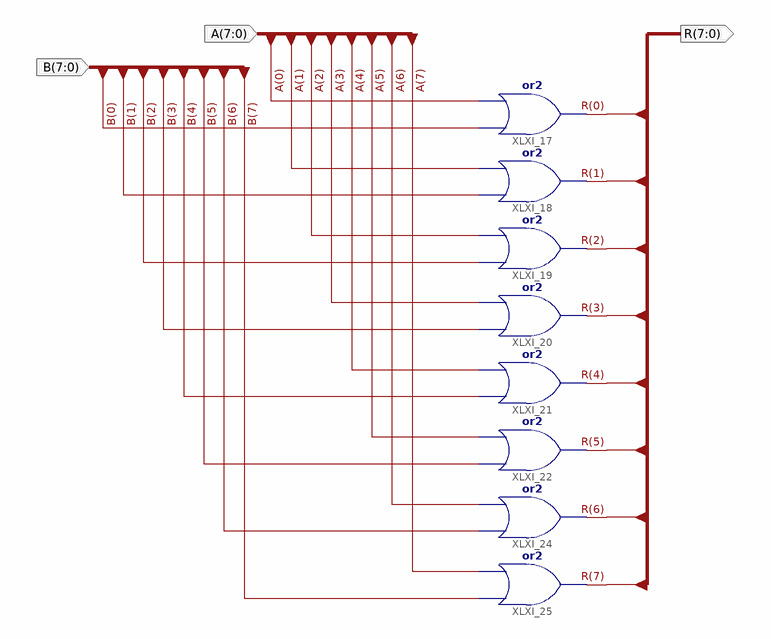
[diagram p0: schematic sheet 1]
// Xilinx ISE schematic or2x8b.sch (spartan6) as structural Verilog: 8 symbols, 3 ports
module or2x8b (
  input  [7:0] B,
  input  [7:0] A,
  output [7:0] R
);

  or XLXI_17 (R[0], B[0], A[0]);
  or XLXI_18 (R[1], B[1], A[1]);
  or XLXI_19 (R[2], B[2], A[2]);
  or XLXI_20 (R[3], B[3], A[3]);
  or XLXI_21 (R[4], B[4], A[4]);
  or XLXI_22 (R[5], B[5], A[5]);
  or XLXI_24 (R[6], B[6], A[6]);
  or XLXI_25 (R[7], B[7], A[7]);
endmodule
